# EAGLE design PolivoksVCF (EAGLE 8.3.1)
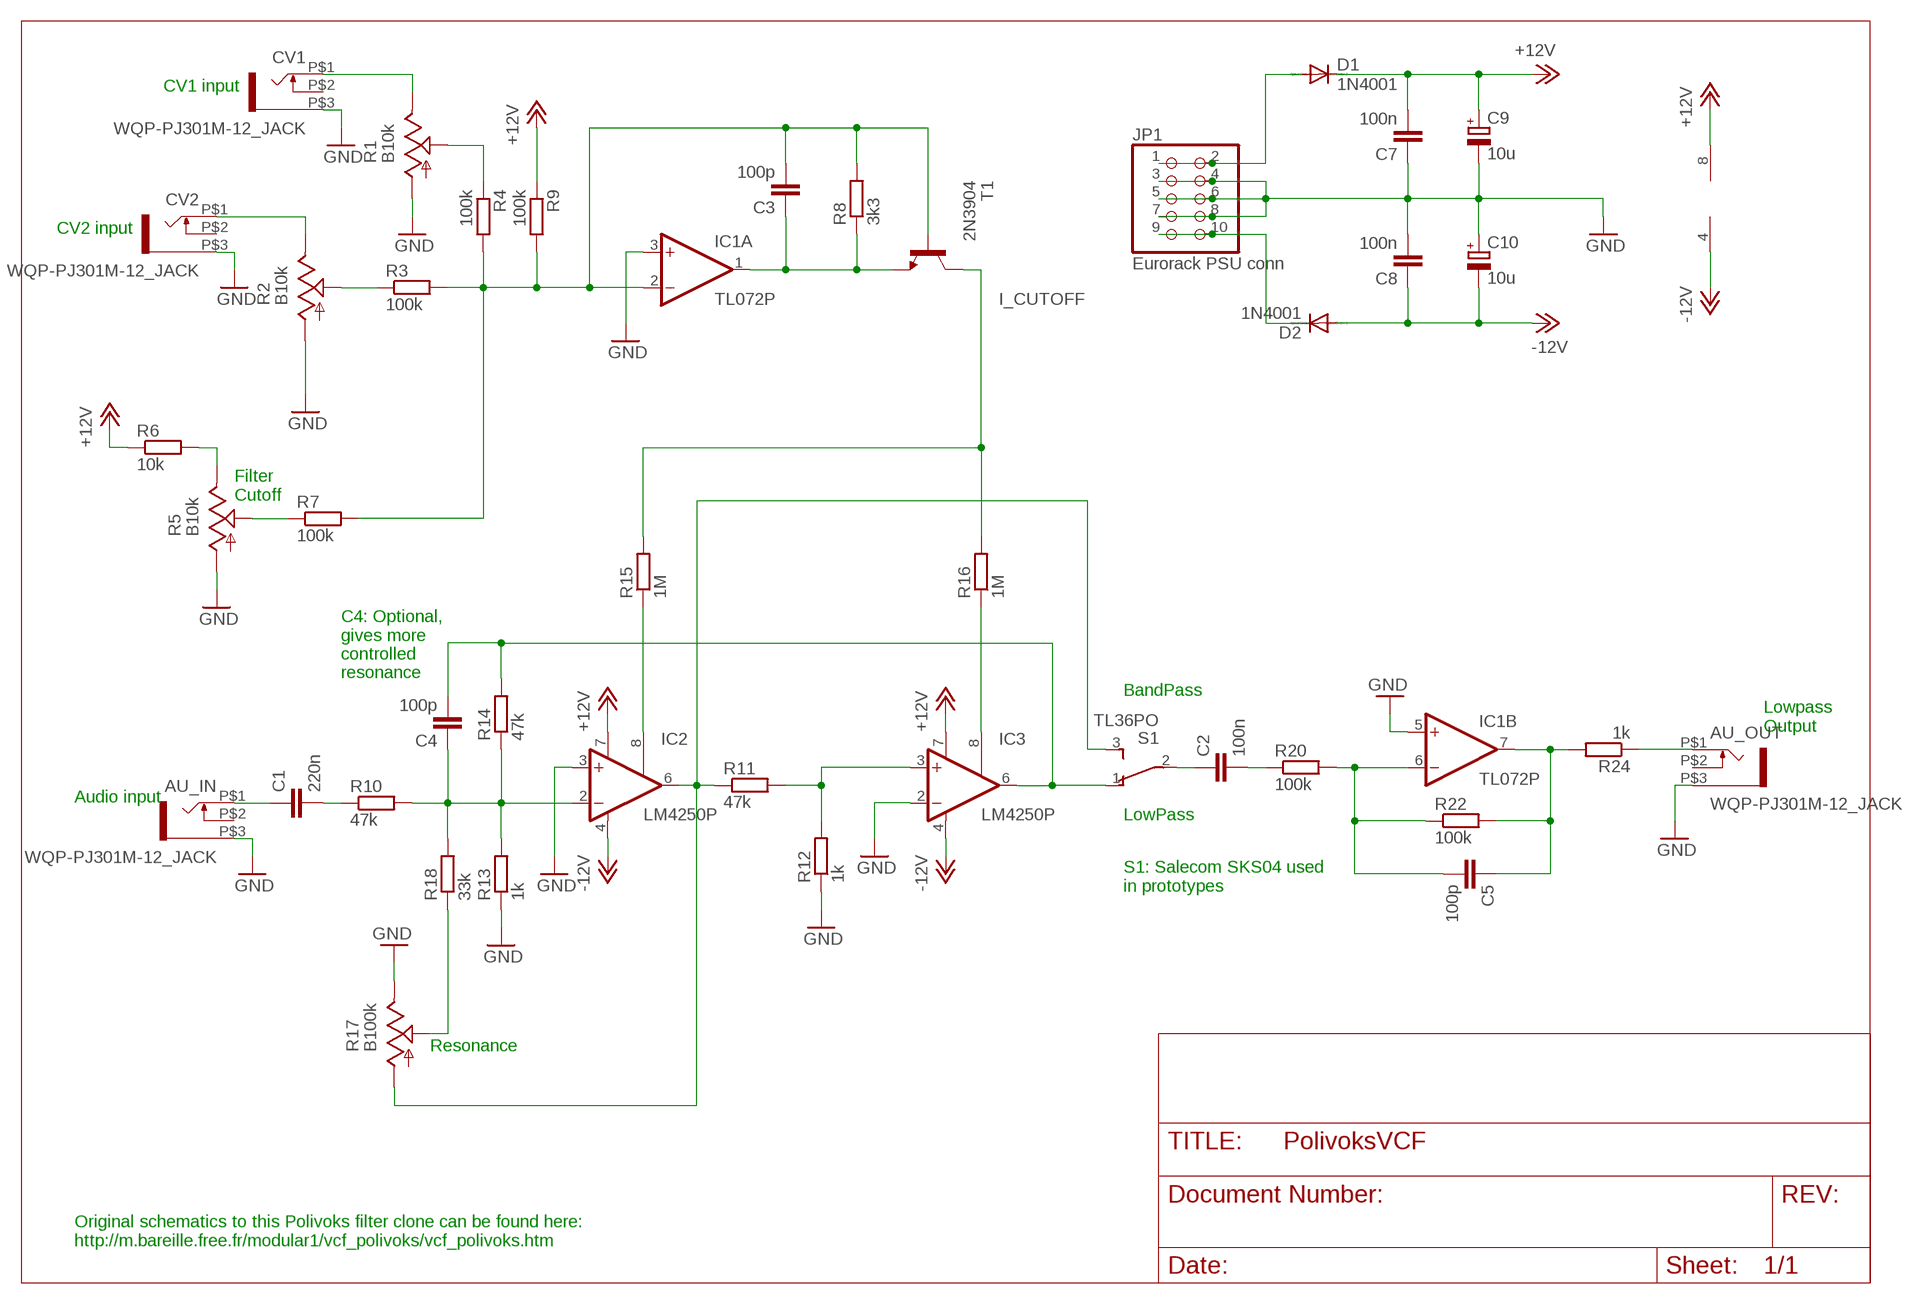
[diagram p0: schematic, sheet 1]

## Parts
AU_IN  WQP-PJ301M-12_JACK  [WQP-PJ301M-12_JACK]
AU_OUT  WQP-PJ301M-12_JACK  [WQP-PJ301M-12_JACK]
C1  220n  C-EU050-045X075  [C050-045X075]
C2  100n  C-EU050-025X075  [C050-025X075]
C3  100p  C-EU025-025X050  [C025-025X050]
C4  100p  C-EU025-025X050  [C025-025X050]
C5  100p  C-EU025-025X050  [C025-025X050]
C7  100n  C-EU025-025X050  [C025-025X050]
C8  100n  C-EU025-025X050  [C025-025X050]
C9  10u  CPOL-EUE2.5-5  [E2,5-5]
C10  10u  CPOL-EUE2.5-5  [E2,5-5]
CV1  WQP-PJ301M-12_JACK  [WQP-PJ301M-12_JACK]
CV2  WQP-PJ301M-12_JACK  [WQP-PJ301M-12_JACK]
D1  1N4001  DIODE-D-5  [D-5]
D2  1N4001  DIODE-D-5  [D-5]
IC1  TL072P  [DIL08]
IC2  LM4250P  [DIL08]
IC3  LM4250P  [DIL08]
JP1  Eurorack PSU conn  PINHD-2X5  [2X05]
R1  B10k  POT_USVERTICAL  [ALPS_POT_VERTICAL]
R2  B10k  POT_USVERTICAL  [ALPS_POT_VERTICAL]
R3  100k  R-EU_0207/2V  [0207/2V]
R4  100k  R-EU_0207/2V  [0207/2V]
R5  B10k  POT_USVERTICAL  [ALPS_POT_VERTICAL]
R6  10k  R-EU_0207/2V  [0207/2V]
R7  100k  R-EU_0207/2V  [0207/2V]
R8  3k3  R-EU_0207/2V  [0207/2V]
R9  100k  R-EU_0207/2V  [0207/2V]
R10  47k  R-EU_0207/2V  [0207/2V]
R11  47k  R-EU_0207/2V  [0207/2V]
R12  1k  R-EU_0207/2V  [0207/2V]
R13  1k  R-EU_0207/2V  [0207/2V]
R14  47k  R-EU_0207/2V  [0207/2V]
R15  1M  R-EU_0207/2V  [0207/2V]
R16  1M  R-EU_0207/2V  [0207/2V]
R17  B100k  POT_USVERTICAL  [ALPS_POT_VERTICAL]
R18  33k  R-EU_0207/2V  [0207/2V]
R20  100k  R-EU_0207/2V  [0207/2V]
R22  100k  R-EU_0207/2V  [0207/2V]
R24  1k  R-EU_0207/2V  [0207/2V]
S1  TL36PO  [TL3XPO]
T1  2N3904  2N3904-NPN-TO92-EBC  [TO92-EBC]

## Nets
+12V: C7.2 C9.+ D1.C IC1.8(P:V+) IC2.7(V+) IC3.7(V+) R6.1 R9.1
-12V: C8.1 C10.- D2.A IC1.4(P:V-) IC2.4(V-) IC3.4(V-)
BP_OUT: IC2.6(OUT) R11.1 R17.P$3(A) S1.3(S)
GND: AU_IN.P$3 AU_OUT.P$3 C7.1 C8.2 C9.- C10.+ CV1.P$3 CV2.P$3 IC1.3(A:+IN) IC1.5(B:+IN) IC2.3(+IN) IC3.2(-IN) JP1.3 JP1.4 JP1.5 JP1.6 JP1.7 JP1.8 R1.P$3(A) R2.P$3(A) R5.P$3(A) R12.1 R13.1 R17.P$1(E)
I_CUTOFF: R15.2 R16.2 T1.C
LP_OUT: C4.2 IC3.6(OUT) R14.2 S1.1(O)
N$1: CV1.P$1 R1.P$1(E)
N$2: CV2.P$1 R2.P$1(E)
N$3: R5.P$1(E) R6.2
N$4: R5.P$2(S) R7.1
N$5: R2.P$2(S) R3.1
N$6: R1.P$2(S) R4.1
N$7: C3.2 IC1.2(A:-IN) R3.2 R4.2 R7.2 R8.2 R9.2 T1.B
N$8: C3.1 IC1.1(A:OUT) R8.1 T1.E
N$9: AU_IN.P$1 C1.1
N$10: C1.2 R10.1
N$11: C4.1 IC2.2(-IN) R10.2 R13.2 R14.1 R18.2
N$12: IC3.3(+IN) R11.2 R12.2
N$13: IC2.8(ISET) R15.1
N$14: IC3.8(ISET) R16.1
N$15: C2.1 S1.2(P)
N$16: R17.P$2(S) R18.1
N$17: C5.1 IC1.7(B:OUT) R22.2 R24.2
N$18: C2.2 R20.1
N$19: C5.2 IC1.6(B:-IN) R20.2 R22.1
N$24: AU_OUT.P$1 R24.1
N$27: D1.A JP1.1 JP1.2
N$28: D2.C JP1.9 JP1.10
Unconnected: AU_IN.P$2 AU_OUT.P$2 CV1.P$2 CV2.P$2

## Notes on the sheet
- CV1 input
- CV2 input
- Filter
  Cutoff
- C4: Optional,
  gives more
  controlled
  resonance
- BandPass
- Lowpass
  Output
- Audio input
- LowPass
- S1: Salecom SKS04 used
  in prototypes
- Resonance
- Original schematics to this Polivoks filter clone can be found here:
  http://m.bareille.free.fr/modular1/vcf_polivoks/vcf_polivoks.htm

## Library data of the parts
AU_IN AU_OUT CV1 CV2 = thonkiconn:WQP-PJ301M-12_JACK
C1-C5 C7 C8 = rcl:C-EU: CAPACITOR, European symbol
C9 C10 = rcl:CPOL-EU: POLARIZED CAPACITOR, European symbol
D1 D2 = diode:DIODE-: DIODE
IC1 = linear:TL072: OP AMP
IC2 IC3 = og-ics-polivoks:LM4250: OP AMP
JP1 = pinhead:PINHD-2X5: PIN HEADER
R1 R2 R5 R17 = pot-alps:POT_US
R3 R4 R6-R16 R18 R20 R22 R24 = rcl:R-EU_: RESISTOR, European symbol
S1 = switch:TL36PO: TINY SWITCH ON - ON Source: http://www2.produktinfo.conrad.com/datenblaetter/700000-724999/705152-da-01-de-Subminiaturschalter_TL_36YO.pdf
T1 = transistor-neu-to92:*-NPN-: NPN Transistror

## Board
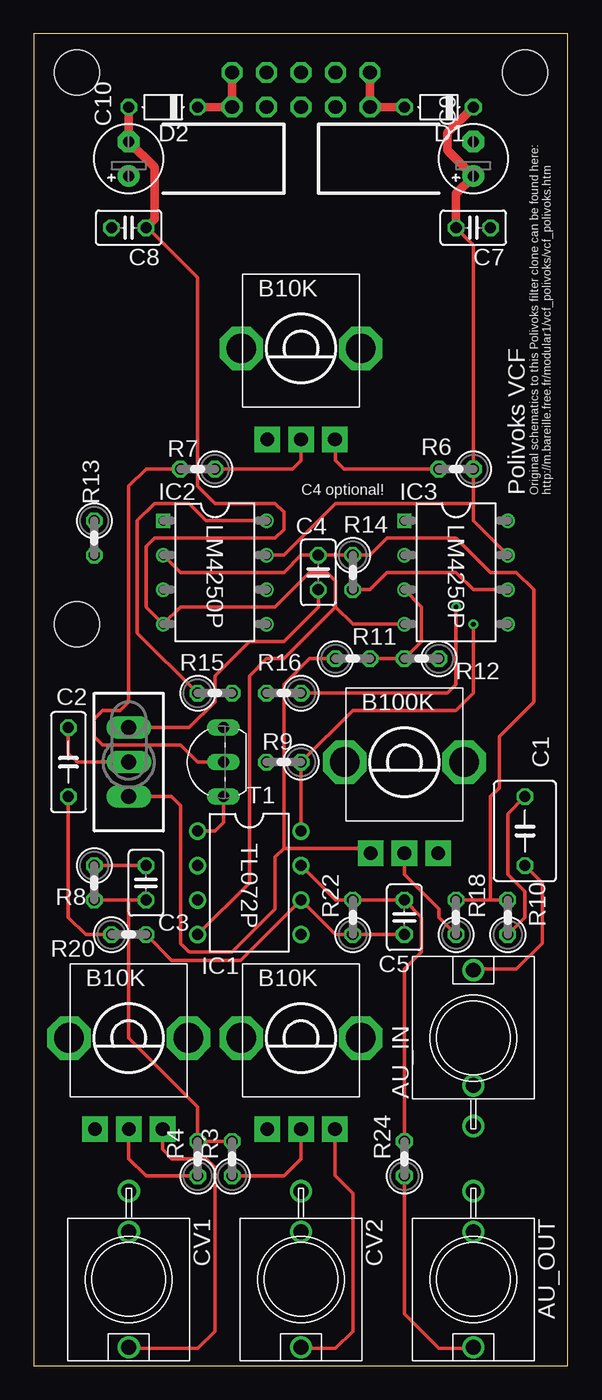
[diagram p1: board, top side]
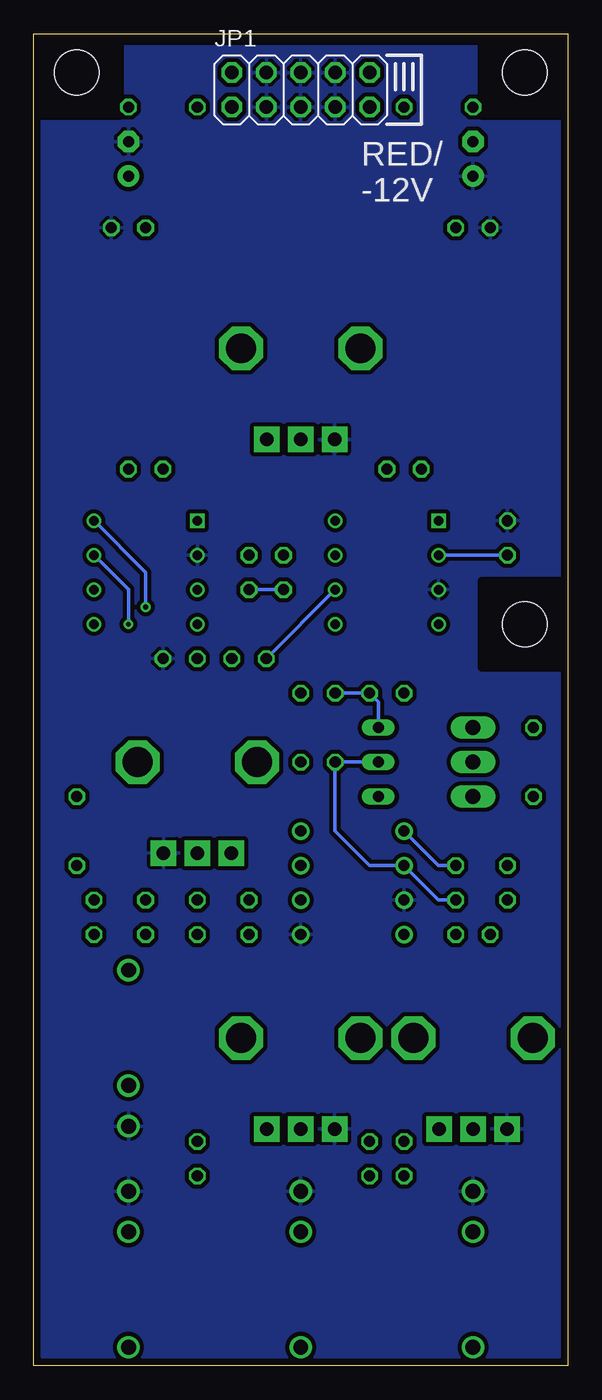
[diagram p2: board, bottom side, seen from below]

Size 39.35 x 98.09 mm. Coordinates in mm from the lower left corner, seen from the top.
Outline: 0,0 39.35,0 39.35,98.09 0,98.09 0,0
Copper layers (1*16): Top 0.0356mm / dielectric 1.5011mm / Bottom 0.0356mm
Design rules "Laen OSH Park PCBOrder": minimum track width 6mil, minimum drill 13mil, track to track 6mil, track to pad 6mil, pad to pad 6mil, via to via 6mil, smd to smd 6mil, copper to edge 15mil, drill to drill 6mil, minimum pad ring 7mil, minimum via ring 7mil, stop-mask expansion 3mil, vias tented up to drill 0mil, thermal gap 10mil
Holes 3.3 mm at 3.17,54.61 3.17,95.25 36.2,95.25
bRestrict: area 0.6,51.4 to 6.4,57.8; area 0.6,92.1 to 6.4,98.4; area 33,92.1 to 38.7,98.4

### Footprints (pad centres in the part's own frame; a part is rotated, then mirrored left to right if it is on the bottom)
WQP-PJ301M-12_JACK = drill 1.1: P$1 0,5; P$2 0,-3.5; P$3 0,-6.5
C050-045X075 = drill 0.813 octagon: 1 -2.54,0; 2 2.54,0
C050-025X075 = drill 0.813 octagon: 1 -2.54,0; 2 2.54,0
C025-025X050 = drill 0.813 octagon: 1 -1.27,0; 2 1.27,0
E2,5-5 = drill 0.813 pad 1.6: + -1.27,0 | drill 0.813 pad 1.6 octagon: - 1.27,0
D-5 = drill 0.813 octagon: A 2.54,0; C -2.54,0
DIL08 = drill 0.813 pad 1.27: 1 -3.81,-3.81; 2 -1.27,-3.81; 3 1.27,-3.81; 4 3.81,-3.81; 5 3.81,3.81; 6 1.27,3.81; 7 -1.27,3.81; 8 -3.81,3.81
DIL08' = drill 0.7 square: 1 -3.81,-3.81 | drill 0.7: 2 -1.27,-3.81; 3 1.27,-3.81; 4 3.81,-3.81; 5 3.81,3.81; 6 1.27,3.81; 7 -1.27,3.81; 8 -3.81,3.81
2X05 = drill 1.016 octagon: 1 -5.08,-1.27; 2 -5.08,1.27; 3 -2.54,-1.27; 4 -2.54,1.27; 5 0,-1.27; 6 0,1.27; 7 2.54,-1.27; 8 2.54,1.27; 9 5.08,-1.27; 10 5.08,1.27
ALPS_POT_VERTICAL = drill 1 pad 1.88 square: P$1 -2.5,6.7; P$2 0,6.7; P$3 2.5,6.7 | drill 2.2 pad 3.175 octagon: P$4 -4.4,0; P$5 4.4,0
0207/2V = drill 0.813 octagon: 1 -1.27,0; 2 1.27,0
TL3XPO = drill 1.1 pad 1.422 long: 1 -2.54,0; 2 0,0; 3 2.54,0
TO92-EBC = drill 0.813 long: B 0,-1.27; C 2.54,-1.27; E -2.54,-1.27

### Placement (x,y rotation side)
AU_IN  32.39,24.13 0 top
AU_OUT  32.39,6.35 180 top
C1  36.2,39.37 90 top
C2  2.54,44.45 270 top
C3  8.26,35.56 270 top
C4  20.95,58.42 270 top
C5  27.3,33.02 270 top
C7  32.39,83.82 180 top
C8  6.99,83.82 180 top
C9  32.39,88.9 90 top
C10  6.99,88.9 90 top
CV1  6.99,6.35 180 top
CV2  19.68,6.35 180 top
D1  29.84,92.71 180 top
D2  9.53,92.71 180 top
IC1  15.88,35.56 270 top
IC2  LM4250P  [DIL08']  13.34,58.42 270 top
IC3  LM4250P  [DIL08']  31.11,58.42 270 top
JP1  19.68,93.98 0 bottom
R1  6.99,24.13 180 top
R2  19.68,24.13 180 top
R3  14.61,15.24 90 top
R4  12.06,15.24 90 top
R5  19.68,74.93 180 top
R6  31.11,66.04 180 top
R7  12.06,66.04 180 top
R8  4.45,35.56 270 top
R9  18.41,44.45 180 top
R10  34.93,33.02 90 top
R11  23.49,52.07 0 top
R12  28.57,52.07 180 top
R13  4.45,60.96 270 top
R14  23.49,58.42 270 top
R15  13.34,49.53 0 top
R16  18.41,49.53 180 top
R17  27.3,44.45 180 top
R18  31.11,33.02 90 top
R20  6.99,31.75 0 top
R22  23.49,33.02 90 top
R24  27.3,15.24 90 top
S1  6.99,44.45 270 top
T1  12.7,44.45 90 top

### Tracks (layer width: path | path; a pad name or v marks a point on that pad's centre or on a via)
+12V  (via drill 0.35)
  Top 0.254: IC1.8 R9.1 23.49,48.26 31.11,48.26 32.39,49.53 v32.39,54.61 | IC3.7 32.39,62.23 32.39,63.5 | 32.39,63.5 R6.1 32.39,82.55 C7.2 | 32.39,63.5 32.38,63.5 22.22,63.5 18.41,59.69 IC2.7 | 32.39,87.59 C9.+
  Top 0.61: D1.C 30.48,90.81 30.48,89.54 C9.+ | 32.42,87.63 32.39,87.59 31.11,86.32 C7.2
  Bottom 0.254: v32.39,54.61 32.39,57.15 IC3.7
-12V
  Top 0.254: IC3.4 23.49,54.61 22.22,55.88 | 22.22,55.88 22.22,57.78 21.59,58.42 20.32,58.42 17.78,55.88 10.79,55.88 IC2.4 8.26,55.88 8.26,60.32 8.89,60.96 17.78,60.96 18.41,61.59 18.41,62.87 17.78,63.5 13.34,63.5 12.06,64.77 12.06,80.14 8.32,83.89 | IC1.4 15.88,35.56 15.88,50.8 17.14,52.07 18.41,52.07 22.22,55.88
  Top 0.61: D2.A C10.- 8.89,88.27 8.89,84.45 8.32,83.89 C8.1
BP_OUT
  Top 0.254: S1.3 10.16,41.91 10.79,41.27 10.79,31.11 11.43,30.48 14.61,30.48 17.78,33.65 17.78,37.46 18.41,38.1 | 18.41,38.1 24.45,38.1 R17.P$3 | 20.33,52.07 R11.1 | 20.33,52.07 20.32,52.07 18.41,50.16 18.41,38.1 | 20.32,52.08 20.33,52.07
  Bottom 0.254: IC2.6 R11.1
GND
  pour Bottom (isolate 0.305): 0.64,97.16 38.73,97.16 38.73,0.64 0.64,0.64
I_CUTOFF
  Bottom 0.254: R16.2 R15.2 13.97,48.89 T1.C
LP_OUT
  Top 0.254: R14.2 24.76,57.15 26.04,58.42 31.11,58.42 32.39,57.15 IC3.6 | C4.2 20.95,55.88 18.41,53.34 15.88,53.34 13.34,50.8 13.34,48.89 11.43,46.99 S1.1
  Bottom 0.254: R14.2 C4.2
N$1
  Top 0.254: R1.P$1 9.48,15.91 10.16,15.24 12.7,15.24 13.34,14.61 13.34,2.54 12.06,1.27 7.07,1.27 CV1.P$1
N$2
  Top 0.254: R2.P$1 22.18,14.01 23.49,12.7 23.49,2.54 22.22,1.27 19.76,1.27 CV2.P$1
N$3
  Top 0.254: R6.2 22.86,66.04 22.22,66.67 22.22,68.19 R5.P$1
N$4
  Top 0.254: R5.P$2 19.68,66.67 19.05,66.04 R7.1
N$5
  Top 0.254: R2.P$2 19.68,15.24 18.41,13.97 R3.1
N$6
  Top 0.254: R4.1 8.26,13.97 6.99,15.24 R1.P$2
N$7
  Top 0.254: 7.01,34.29 R8.2 | 7.01,34.29 C3.2 | R7.2 8.26,66.04 6.99,64.77 6.99,48.89 6.35,48.26 5.08,48.26 4.45,47.62 4.45,46.35 5.08,45.72 10.79,45.72 12.06,44.45 T1.B | 7.01,34.29 6.99,34.26 6.99,24.13 12.06,19.05 R4.2 R3.2
  Bottom 0.254: T1.B R9.2 17.14,39.37 14.61,36.83 IC1.2 9.53,34.29 C3.2
N$8
  Top 0.254: C3.1 R8.1 | IC1.1 13.34,39.37 13.97,40 T1.E
  Bottom 0.254: C3.1 9.53,36.83 IC1.1
N$9
  Top 0.254: C1.1 37.47,35.56 37.47,31.11 35.56,29.21 32.47,29.21 AU_IN.P$1
N$10
  Top 0.254: C1.2 34.93,40.64 34.93,36.2 36.2,34.92 36.2,33.02 R10.1
N$11
  Top 0.254: IC2.2 10.79,58.42 18.41,58.42 19.68,59.69 C4.1 R14.1 24.76,59.69 26.04,60.96 31.11,60.96 33.66,58.42 35.56,58.42 36.83,57.15 36.83,48.89 34.29,46.35 34.29,42.54 33.66,41.91 33.66,34.29 | 33.66,34.29 R10.2 | 33.66,34.29 R18.2
  Bottom 0.254: R13.2 IC2.2
N$12
  Top 0.254: R11.2 R12.2 28.57,53.34 28.57,55.88 IC3.3
N$13
  Top 0.254: IC2.8 12.7,62.23 11.43,63.5 8.89,63.5 7.62,62.23 7.62,53.97 R15.1
N$14  (via drill 0.35)
  Top 0.254: R16.1 30.48,49.53 31.11,50.16 v31.11,55.88
  Bottom 0.254: v31.11,55.88 31.11,58.42 IC3.8
N$15
  Top 0.254: C2.1 2.54,45.08 3.17,44.45 S1.2
N$16
  Top 0.254: R17.P$2 27.3,36.2 29.84,33.65 29.84,33.02 R18.1
N$17
  Top 0.254: IC1.7 22.22,34.29 R22.2 C5.1 28.57,33.02 28.57,30.48 27.3,29.21 R24.2
N$18
  Top 0.254: C2.2 2.54,33.02 3.81,31.75 R20.1
N$19
  Top 0.254: C5.2 R22.1 22.22,31.75 IC1.6 15.24,29.84 10.16,29.84 R20.2
N$24
  Top 0.254: R24.1 27.3,3.81 29.84,1.27 32.3,1.27 AU_OUT.P$1
N$27
  Top 0.61: JP1.2 JP1.1 D1.A
N$28
  Top 0.61: D2.C JP1.9 JP1.10

### Text on the board
tPlace: B10K | C4 optional! | Polivoks VCF | Original schematics to this Polivoks filter clone can be found here: / http://m.bareille.free.fr/modular1/vcf_polivoks/vcf_polivoks.htm | B100K | B10K | B10K
bPlace: RED/ / -12V